# EAGLE design chain (EAGLE 7.3.0)
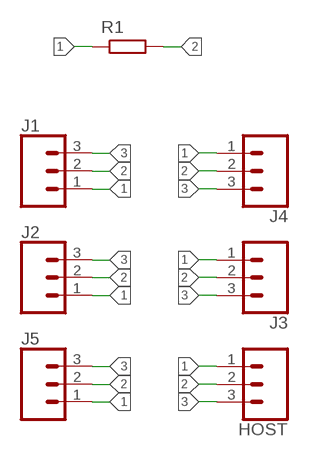
[diagram p0: schematic, sheet 1]

## Parts
HOST  CONN_03LONGPADS  [1X03_LONGPADS]
J1  CONN_03LONGPADS  [1X03_LONGPADS]
J2  CONN_03LONGPADS  [1X03_LONGPADS]
J3  CONN_03LONGPADS  [1X03_LONGPADS]
J4  CONN_03LONGPADS  [1X03_LONGPADS]
J5  CONN_03LONGPADS  [1X03_LONGPADS]
R1  RESISTOR0603-N  [R0603-N]

## Nets
1: HOST.1 J1.1 J2.1 J3.1 J4.1 J5.1 R1.1
2: HOST.2 J1.2 J2.2 J3.2 J4.2 J5.2 R1.2
3: HOST.3 J1.3 J2.3 J3.3 J4.3 J5.3

## Library data of the parts
HOST J1-J5 = SparkFun-Connectors:CONN_03: Multi connection point. Often used as Generic Header-pin footprint for 0.1 inch spaced/style header connections On any of the 0.1 inch spaced packages, you can populate with these: Break Away Headers - Straight <https://www.sparkfun.com/products/116> (PRT-00116) Break Away Male Headers - Right Angle <https://www.sparkfun.com/products/553> (PRT-00553) Female Headers <https://www.sparkfun.com/products/115> (PRT-00115) Break Away Headers - Machine Pin <https://www.sparkfun.com/products/117> (PRT-00117) Break Away Female Headers - Swiss Machine Pin <https://www.sparkfun.com/products/743> (PRT-00743) Stackable Header - 3 Pin (Female, 0.1") <https://www.sparkfun.com/products/13875> (PRT-13875) For SCREWTERMINALS and SPRING TERMINALS visit here: Screw Terimnals on SparkFun.com <https://www.sparkfun.com/search/results?term=Screw+Terminals> (5mm/3.5mm/2.54mm spacing) This device is also useful as a general connection point to wire up your design to another part of your project. Our various solder wires solder well into these plated through hole pads. Hook-Up Wire - Assortment (Stranded, 22 AWG) <https://www.sparkfun.com/products/11375> (PRT-11375) Hook-Up Wire - Assortment (Solid Core, 22 AWG) <https://www.sparkfun.com/products/11367> (PRT-11367) View the entire wire category on our website here <https://www.sparkfun.com/categories/141> Special notes: Molex polarized connector foot print use with SKU : PRT-08232 with associated crimp pins and housings.
R1 = passives-7351:RESISTOR

## Board
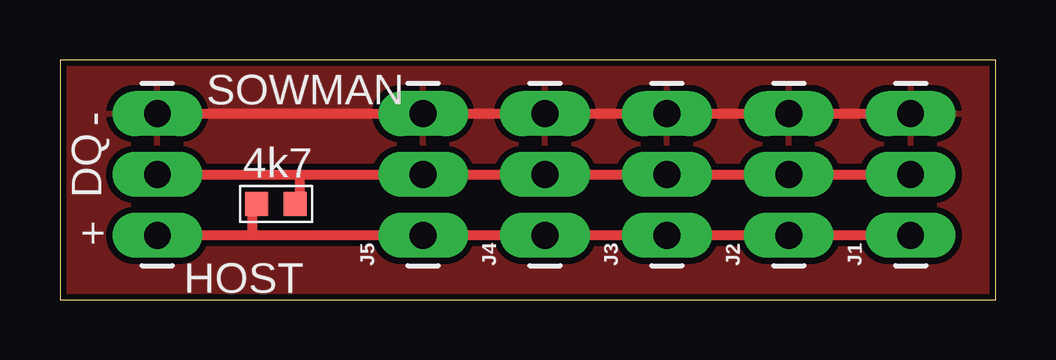
[diagram p1: board, top side]

Size 39 x 10 mm. Coordinates in mm from the lower left corner, seen from the top.
Outline: 0,0 39,0 39,10 0,10 0,0
Copper layers (1*16): Top 0.035mm / dielectric 1.5mm / Bottom 0.035mm
Design rules "dirt_cheap_dirty_boards.v1": minimum track width 5mil, minimum drill 12mil, track to track 5mil, track to pad 5mil, pad to pad 5mil, via to via 5mil, smd to smd 0mil, copper to edge 10mil, drill to drill 10mil, minimum pad ring 10mil, minimum via ring 6mil, stop-mask expansion 2mil, vias tented up to drill 25mil, thermal gap 10mil

### Footprints (pad centres in the part's own frame; a part is rotated, then mirrored left to right if it is on the bottom)
1X03_LONGPADS = drill 1.118 pad 1.88 long: 1 0,0; 2 2.54,0; 3 5.08,0
R0603-N = smd 0.95 x 1: 1 -0.8,0; 2 0.8,0

### Placement (x,y rotation side)
HOST  4.06,2.68 90 top
J1  35.46,2.68 90 top
J2  30.38,2.68 90 top
J3  25.3,2.68 90 top
J4  20.22,2.68 90 top
J5  15.14,2.68 90 top
R1  9,4 0 top

### Tracks (layer width: path | path; a pad name or v marks a point on that pad's centre or on a via)
1
  Top 0.406: J1.1 J2.1 J3.1 J4.1 J5.1 8,2.68 | 8,2.68 HOST.1 | R1.1 8,4 8,2.68
2
  Top 0.406: HOST.2 10,5.22 | 10,5.22 J5.2 J4.2 J3.2 J2.2 J1.2 | R1.2 10,4 10,5.22
3
  Top 0.406: HOST.3 J5.3 J4.3 J3.3 J2.3 J1.3
  pour Top (isolate 0.254): 0,0 39,0 arc6 39,10 0,9.91

### Text on the board
tPlace: SOWMAN | - | 4k7 | DQ | +